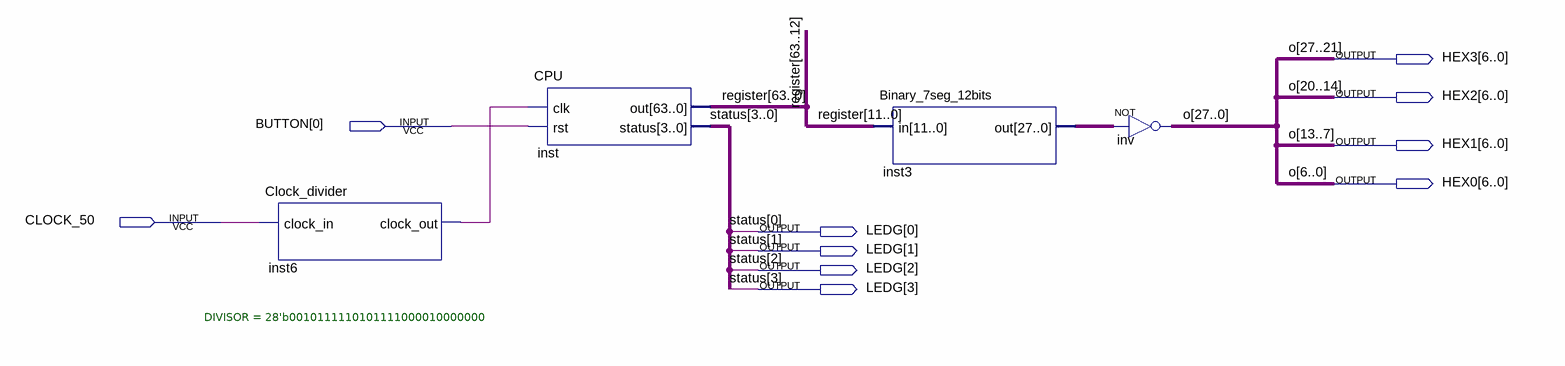
[diagram p0: schematic sheet]
// Quartus schematic r0-to-7seg.bdf as structural Verilog: 4 symbols, 10 pins
module \r0-to-7seg  (
  input  [0:0] BUTTON,
  input  CLOCK_50,
  output [6:0] HEX3,
  output [6:0] HEX2,
  output [6:0] HEX1,
  output [6:0] HEX0,
  output [3:0] LEDG
);

  wire inst6_clock_out;
  wire [27:0] inst3_out;
  wire [63:0] register;

  Clock_divider #(.DIVISOR(28'b0010111110101111000010000000)) inst6 (.clock_in(CLOCK_50), .clock_out(inst6_clock_out));
  CPU inst (.clk(inst6_clock_out), .rst(BUTTON[0]), .out(register), .status(LEDG));
  Binary_7seg_12bits inst3 (.in(register[11:0]), .out(inst3_out));
  assign {HEX3, HEX2, HEX1, HEX0} = ~inst3_out;  // NOT inv, 28 bits wide

  // Other names for the same wires on the sheet: o[27:0] = {HEX3, HEX2, HEX1, HEX0}; status[3:0] = LEDG
endmodule
